# Altium project Main.PrjPcb
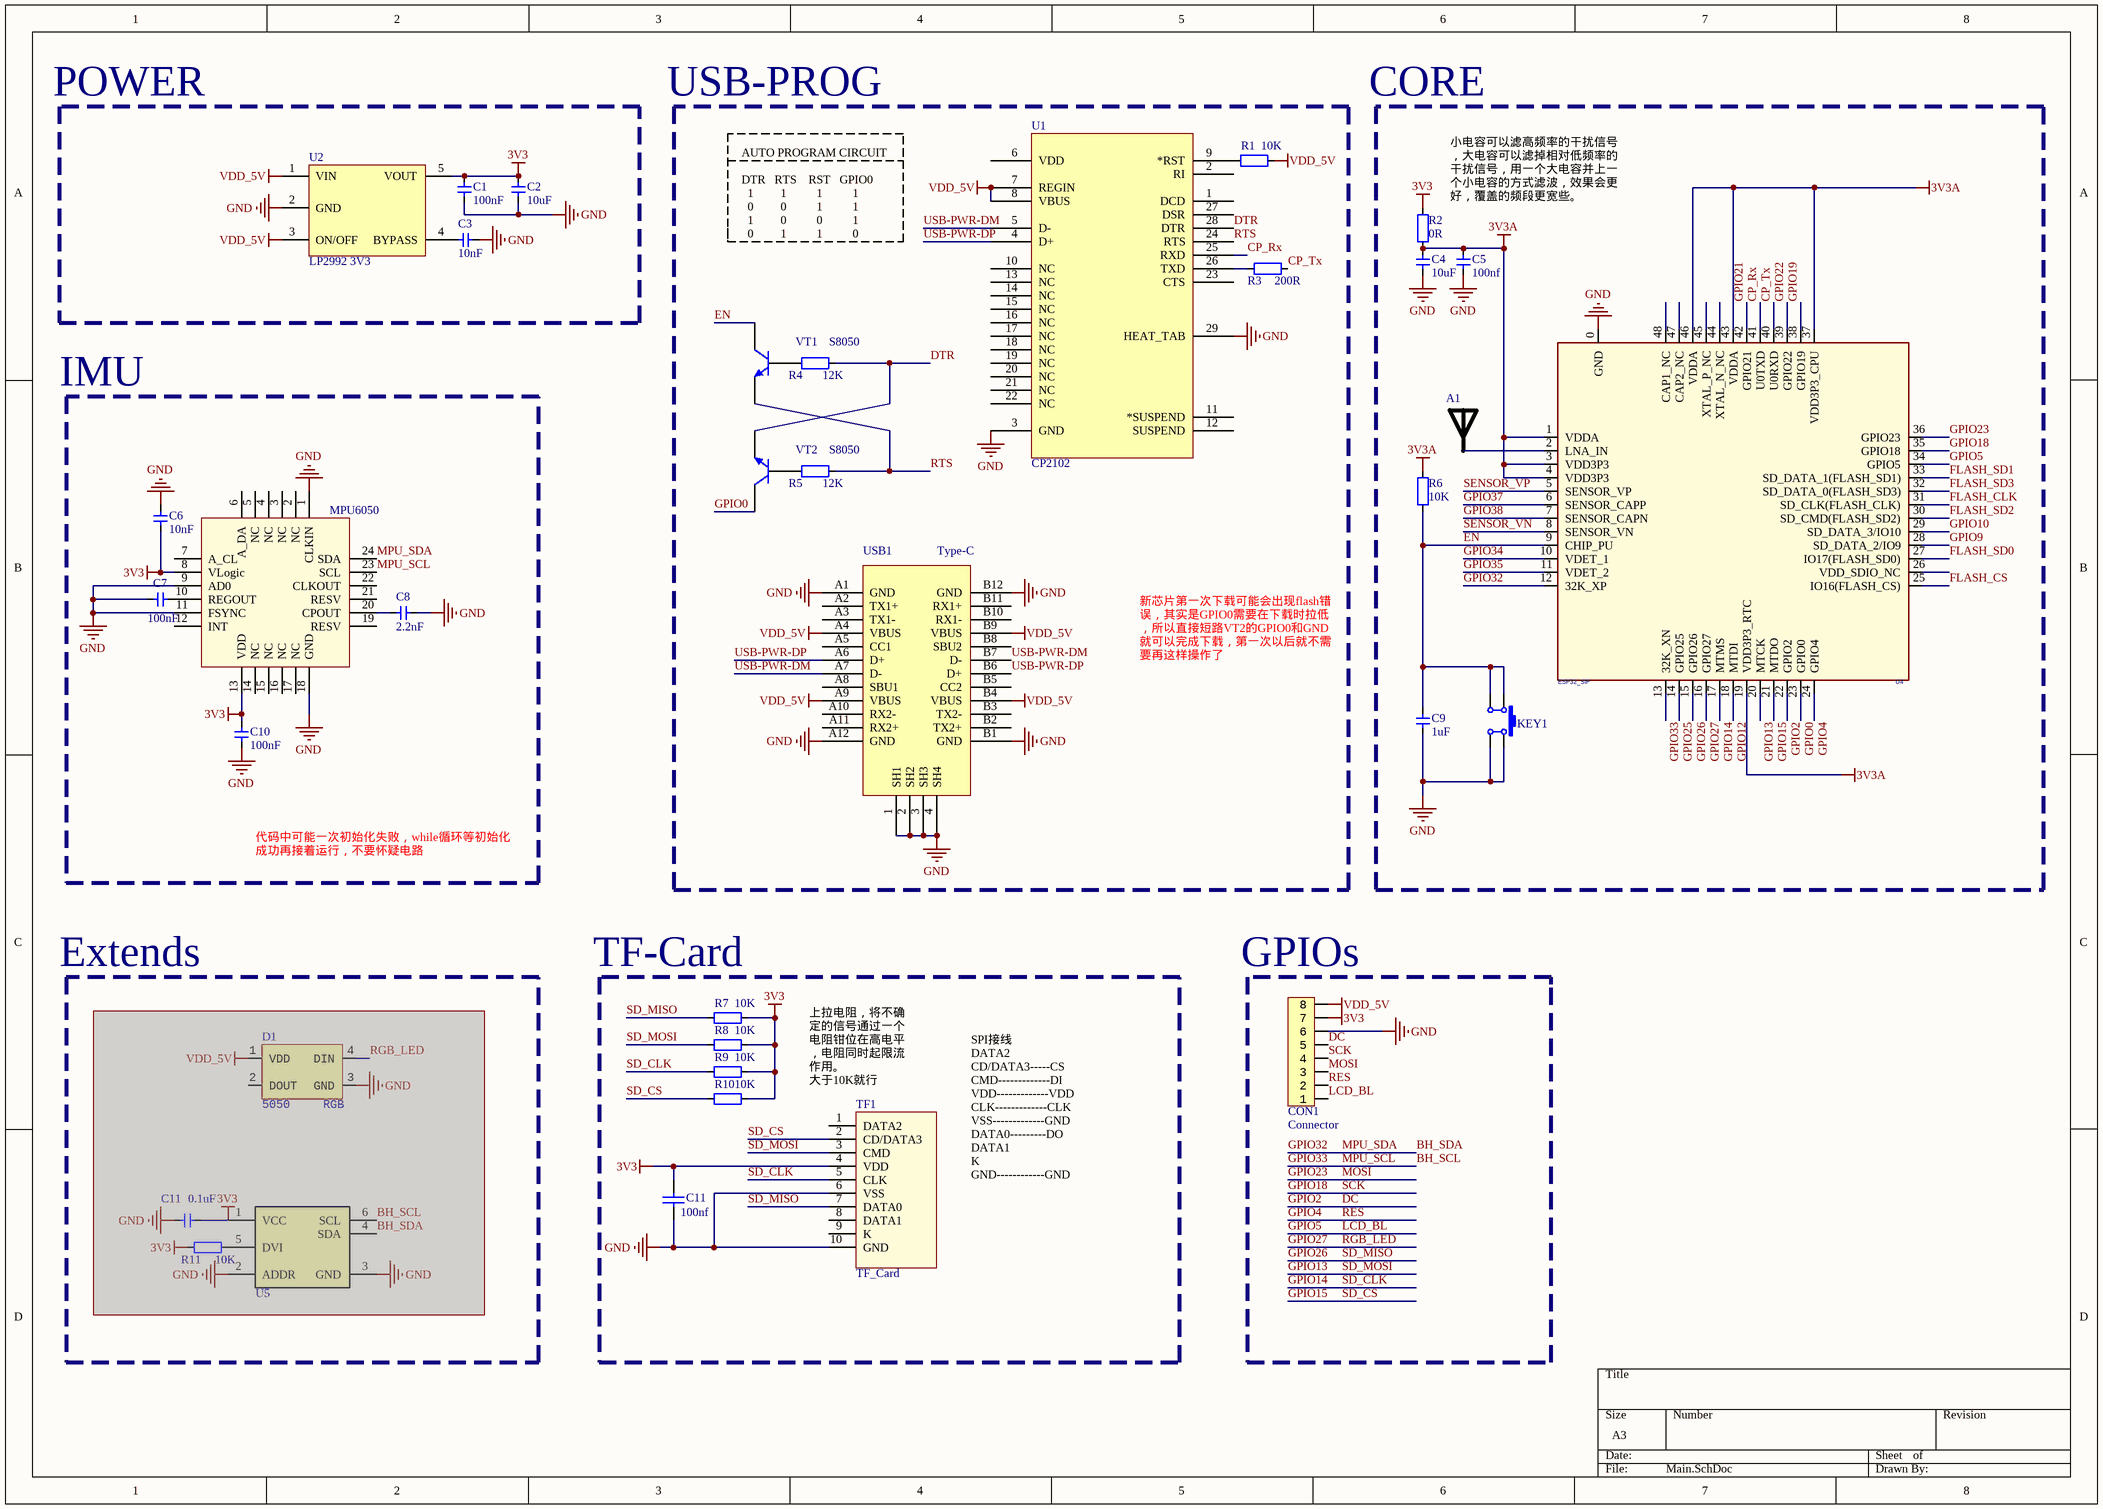
[diagram p0: Main.SchDoc]
1 sheet, 36 parts. Net scope: global (net labels, ports and power ports of the same name join across sheets).
Board file: Main.PcbDoc

## Sheet Main.SchDoc
size A3

### Parts
(Parts that share a designator on the sheet are numbered #1, #2 ... from top to bottom, then left to right.)
A1  RAINSUN  [ANT-Rainsun-AN5120]  (value not drawn)
C1  100nF  [CAP_0402]
C2  10uF  [CAP_0402]
C3  10nF  [CAP_0402]
C4  10uF  [CAP_0402]
C5  100nf  [CAP_0402]
C6  10nF  [CAP_0402]
C7  100nF  [CAP_0402]
C8  2.2nF  [CAP_0402]
C9  1uF  [CAP_0402]
C10  100nF  [CAP_0402]
C11#1  100nf  [C0402_L]
C11#2  0.1uF  [CAP_0402]  (masked out: inside a compile mask, not in the netlist)
CON1  System: Connector  [FFC_0.5_8]  (hidden comment: FFC_0.5_8)
D1  Type: 5050  [LED_5050_WS2812B]  (hidden comment: RGB)  (masked out: inside a compile mask, not in the netlist)
KEY1  4x4x1.5  [SW-SMD_4P-L4.2-W3.3-P2.15-LS5.1]  (value not drawn)
R1  10K  [RES_0402]
R2  0R  [RES_0402]
R3  200R  [RES_0402]
R4  12K  [RES_0402]
R5  12K  [RES_0402]
R6  10K  [RES_0402]
R7  10K  [RES_0402]
R8  10K  [RES_0402]
R9  10K  [RES_0402]
R10  10K  [RES_0402]
R11  10K  [RES_0402]  (masked out: inside a compile mask, not in the netlist)
TF1  TF_Card  [Micro SD]
U1  CP2102  [QFN-28]
U2  LP2992 3V3  [SOT23-5]
U3  MPU6050  [QFN-24]
U4  ESP32_SIP  [QFN-48_7X7]
U5  BH1750FVI-TR  [BH1750FVI]  (value not drawn)  (masked out: inside a compile mask, not in the netlist)
USB1  Type-C  [Type-C-TOP]
VT1  S8050  [SMT_TRIODE_NPN]
VT2  S8050  [SMT_TRIODE_NPN]

### Nets
3V3: C1.2 C2.2 C6.1 C10.2 C11#1.2 CON1.7 R2.1 R7.1 R8.1 R9.1 R10.1 TF1.4(VDD) U2.5(VOUT) U3.8(VLogic) U3.13(VDD)
3V3A: C4.2 C5.2 R2.2 R6.1 U4.1(VDDA) U4.3(VDD3P3) U4.4(VDD3P3) U4.19(VDD3P3_RTC) U4.37(VDD3P3_CPU) U4.43(VDDA) U4.46(VDDA)
GND: C1.1 C2.1 C3.1 C4.1 C5.1 C6.2 C7.2 C8.1 C9.2 C10.1 C11#1.1 CON1.6 KEY1.2 KEY1.3 TF1.6(VSS) TF1.10(GND) U1.3(GND) U1.29(HEAT_TAB) U2.2(GND) U3.1(CLKIN) U3.9(AD0) U3.11(FSYNC) U3.18(GND) U4.0(GND) USB1.1(SH1) USB1.2(SH2) USB1.3(SH3) USB1.4(SH4) USB1.A1(GND) USB1.A12(GND) USB1.B1(GND) USB1.B12(GND)
VDD_5V: CON1.8 R1.1 U1.7(REGIN) U1.8(VBUS) U2.1(VIN) U2.3(ON/OFF) USB1.A4(VBUS) USB1.A9(VBUS) USB1.B4(VBUS) USB1.B9(VBUS)
BH_SCL: U3.23(SCL) U4.13(32K_XN)  [also labelled GPIO33, MPU_SCL]
BH_SDA: U3.24(SDA) U4.12(32K_XP)  [also labelled GPIO32, MPU_SDA]
CP_Rx: U1.25(RXD) U4.41(U0TXD)
CP_Tx: R3.1 U4.40(U0RXD)
DC: CON1.5 U4.22(GPIO2)  [also labelled GPIO2]
DTR: R4.1 U1.28(DTR) VT2.2(E)
EN: C9.1 KEY1.1 KEY1.4 R6.2 U4.9(CHIP_PU) VT1.3(C)
FLASH_CLK: U4.31(SD_CLK(FLASH_CLK))
FLASH_CS: U4.25(IO16(FLASH_CS))
FLASH_SD0: U4.27(IO17(FLASH_SD0))
FLASH_SD1: U4.33(SD_DATA_1(FLASH_SD1))
FLASH_SD2: U4.30(SD_CMD(FLASH_SD2))
FLASH_SD3: U4.32(SD_DATA_0(FLASH_SD3))
GPIO0: U4.23(GPIO0) VT2.3(C)
GPIO4: CON1.2 U4.24(GPIO4)  [also labelled RES]
GPIO5: CON1.1 U4.34(GPIO5)  [also labelled LCD_BL]
GPIO9: U4.28(SD_DATA_2/IO9)
GPIO10: U4.29(SD_DATA_3/IO10)
GPIO12: U4.18(MTDI)
GPIO13: R8.2 TF1.3(CMD) U4.20(MTCK)  [also labelled SD_MOSI]
GPIO14: R9.2 TF1.5(CLK) U4.17(MTMS)  [also labelled SD_CLK]
GPIO15: R10.2 TF1.2(CD/DATA3) U4.21(MTDO)  [also labelled SD_CS]
GPIO18: CON1.4 U4.35(GPIO18)  [also labelled SCK]
GPIO19: U4.38(GPIO19)
GPIO21: U4.42(GPIO21)
GPIO22: U4.39(GPIO22)
GPIO23: CON1.3 U4.36(GPIO23)  [also labelled MOSI]
GPIO25: U4.14(GPIO25)
GPIO26: R7.2 TF1.7(DATA0) U4.15(GPIO26)  [also labelled SD_MISO]
GPIO27: U4.16(GPIO27)  [also labelled RGB_LED]
GPIO34: U4.10(VDET_1)
GPIO35: U4.11(VDET_2)
GPIO37: U4.6(SENSOR_CAPP)
GPIO38: U4.7(SENSOR_CAPN)
RTS: R5.1 U1.24(RTS) VT1.2(E)
SENSOR_VN: U4.8(SENSOR_VN)
SENSOR_VP: U4.5(SENSOR_VP)
USB-PWR-DM: U1.5(D-) USB1.A7(D-) USB1.B7(D-)
USB-PWR-DP: U1.4(D+) USB1.A6(D+) USB1.B6(D+)
NetA1_1: A1.1 U4.2(LNA_IN)
NetC3_2: C3.2 U2.4(BYPASS)
NetC7_1: C7.1 U3.10(REGOUT)
NetC8_2: C8.2 U3.20(CPOUT)
NetR1_2: R1.2 U1.9(*RST)
NetR3_2: R3.2 U1.26(TXD)
NetR4_2: R4.2 VT1.1(B)
NetR5_2: R5.2 VT2.1(B)

Not connected (* = marked no-connect by the designer): TF1 1(DATA2) 8(DATA1) 9(K); U1 1(DCD) 2(RI) 6(VDD) 10(NC) 11(*SUSPEND) 12(SUSPEND) 13(NC) 14(NC) 15(NC) 16(NC) 17(NC) 18(NC) 19(NC) 20(NC) 21(NC) 22(NC) 23(CTS) 27(DSR); U3 2(NC) 3(NC) 4(NC) 5(NC) 6(A_DA) 7(A_CL) 12(INT) 14(NC) 15(NC) 16(NC) 17(NC) 19(RESV) 21(RESV) 22(CLKOUT); U4 26(VDD_SDIO_NC) 44(XTAL_N_NC) 45(XTAL_P_NC) 47(CAP2_NC) 48(CAP1_NC); USB1 A2(TX1+) A3(TX1-) A5(CC1) A8(SBU1) A10(RX2-) A11(RX2+) B2(TX2+) B3(TX2-) B5(CC2) B8(SBU2) B10(RX1-) B11(RX1+)

### Notes on the sheet
- POWER
- USB-PROG
- CORE
- AUTO PROGRAM CIRCUIT
  DTR   RTS    RST   GPIO0
  1         1          1          1
  0         0          1          1
  1         0          0          1
  0         1          1          0
- 小电容可以滤高频率的干扰信号，大电容可以滤掉相对低频率的干扰信号，用一个大电容并上一个小电容的方式滤波，效果会更好，覆盖的频段更宽些。
- IMU
- 新芯片第一次下载可能会出现flash错误，其实是GPIO0需要在下载时拉低，所以直接短路VT2的GPIO0和GND就可以完成下载，第一次以后就不需要再这样操作了
- 代码中可能一次初始化失败，while循环等初始化成功再接着运行，不要怀疑电路
- Extends
- (near R7) TF-Card
- (near CON1) GPIOs
- (near TF1) 上拉电阻，将不确定的信号通过一个电阻钳位在高电平，电阻同时起限流作用。
  大于10K就行
- SPI接线
  DATA2
  CD/DATA3-----CS
  CMD-------------DI
  VDD-------------VDD
  CLK-------------CLK
  VSS-------------GND
  DATA0---------DO
  DATA1
  K
  GND------------GND

### Library data of the parts
A1 = ANT-Rainsun-AP5120
C1-C10 C11#2 = 电容-0402: Capacitor; Value: 0.1u
C11#1 = C: Capacitor; BOM名称: 无极性贴片电容; 联系卖家，免费查找封装: 唯一出售店铺网址https://shop463601444.taobao.com; 封装库来自淘宝卖家ID：黄晶宝石: 其他店铺购入均为盗版假冒封装库，请立即申请退款
CON1 = FFC_0.5_8: FFC
D1 = LED_5050_WS2812B: LED; Value: RGB
KEY1 = TSW SMD-4x4: 贴片4x4轻触开关; pin to pad: 2>4 4>2; 联系卖家，免费查找封装: 唯一出售店铺网址https://shop463601444.taobao.com; BOM名称: 贴片4x4轻触开关
R1-R11 = 电阻-0402: Resistor; Value: 22R
TF1 = TF_Card: TF卡座; 联系卖家，免费技术支持: 唯一出售店铺网址https://shop463601444.taobao.com; BOM名称: TF卡座
U1 = CP2102: USB转TTL; PART DESC: SINGLE-CHIP USB TO UART BRIDGE, QFN28, RoHS.; MFG #1: SILICON LABS; PART NUMBER: CP2102; Value: Value; RefDes: RefDes; Type: DEV
U2 = LP2992: LDO
U3 = MPU6050: 六轴传感器
U4 = ESP32-PICO
USB1 = USB-Type-C-TOP
VT1 VT2 = SMT_TRIODE_NPN: Surface mount NPN transistor, package SOT-23